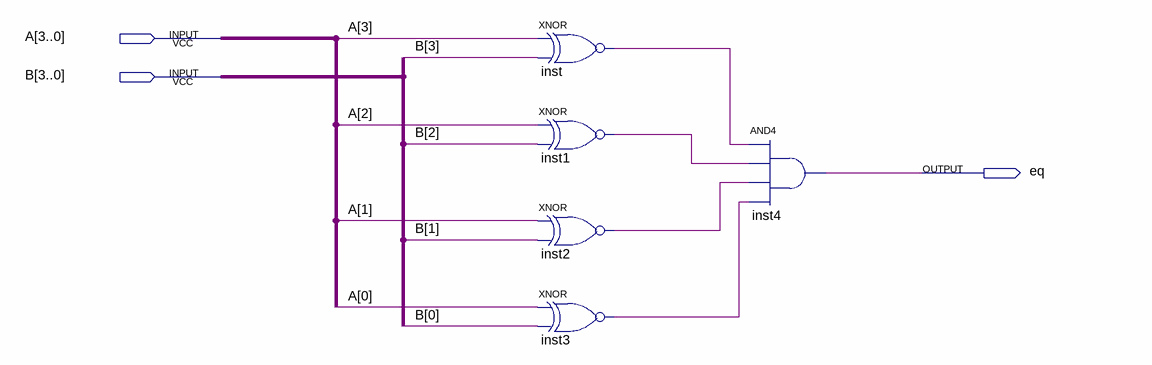
[diagram p0: schematic sheet]
// Quartus schematic eqcom.bdf as structural Verilog: 5 symbols, 3 pins
module eqcom (
  input  [3:0] A,
  input  [3:0] B,
  output eq
);

  wire inst1_out, inst2_out, inst3_out, inst_out;

  xnor inst (inst_out, A[3], B[3]);
  xnor inst1 (inst1_out, A[2], B[2]);
  xnor inst2 (inst2_out, A[1], B[1]);
  xnor inst3 (inst3_out, A[0], B[0]);
  and inst4 (eq, inst_out, inst1_out, inst2_out, inst3_out);
endmodule
